# Altium schematic sheet clusterPlusOpamp.SchDoc
size A3; SheetNumber: 3; SheetTotal: 4
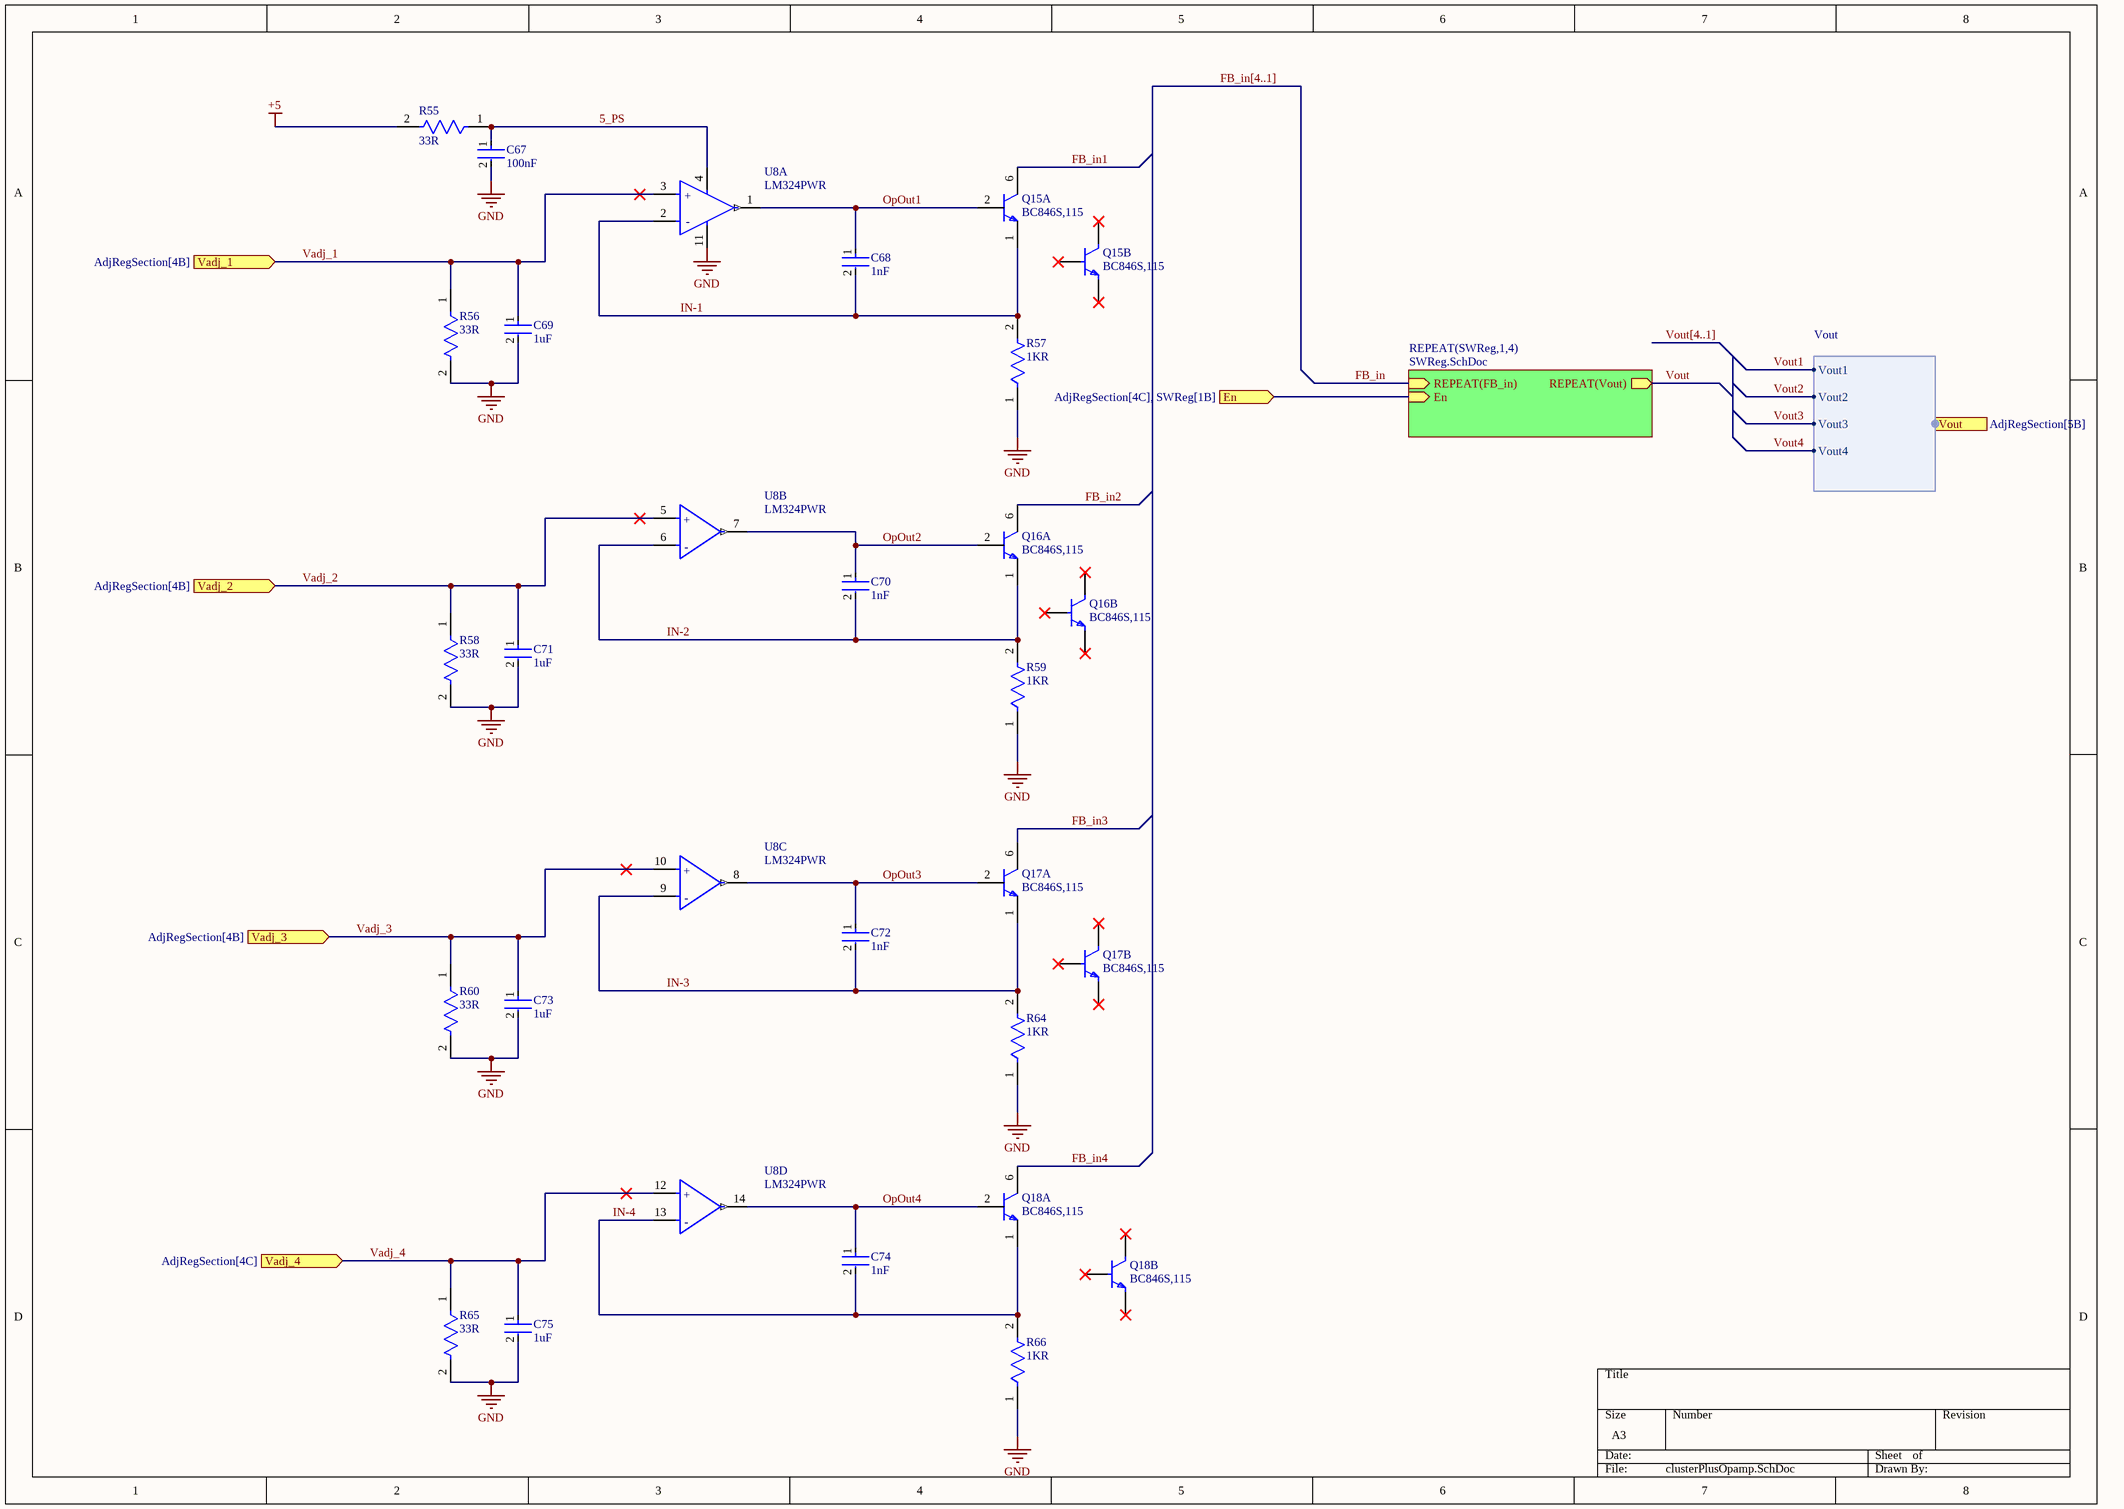
[diagram p0: clusterPlusOpamp.SchDoc]

## Parts
C67  100nF  [FP-CC1206-1_25-MFG]
C68  1nF  [FP-CC1206-1_25-MFG]
C69  1uF  [FP-CC1206-1_25-MFG]
C70  1nF  [FP-CC1206-1_25-MFG]
C71  1uF  [FP-CC1206-1_25-MFG]
C72  1nF  [FP-CC1206-1_25-MFG]
C73  1uF  [FP-CC1206-1_25-MFG]
C74  1nF  [FP-CC1206-1_25-MFG]
C75  1uF  [FP-CC1206-1_25-MFG]
Q15  BC846S,115  [FP-SOT363-MFG]  (parts A,B of 2)
Q16  BC846S,115  [FP-SOT363-MFG]  (parts A,B of 2)
Q17  BC846S,115  [FP-SOT363-MFG]  (parts A,B of 2)
Q18  BC846S,115  [FP-SOT363-MFG]  (parts A,B of 2)
R55  33R  [FP-RC0603-0_55-MFG]
R56  33R  [FP-RC0603-0_55-MFG]
R57  1KR  [FP-RC0603-0_55-MFG]
R58  33R  [FP-RC0603-0_55-MFG]
R59  1KR  [FP-RC0603-0_55-MFG]
R60  33R  [FP-RC0603-0_55-MFG]
R64  1KR  [FP-RC0603-0_55-MFG]
R65  33R  [FP-RC0603-0_55-MFG]
R66  1KR  [FP-RC0603-0_55-MFG]
U8  LM324PWR  [FP-PW0014A-MFG]  (parts A,B,C,D of 4)

## Sub-sheets
REPEAT(SWReg,1,4) = SWReg.SchDoc: REPEAT(Vout) (out), REPEAT(FB_in) (in), En (in)

## Ports
En (in, see AdjRegSection[4C], SWReg[1B]), Vadj_1 (in, see AdjRegSection[4B]), Vadj_2 (in, see AdjRegSection[4B]), Vadj_3 (in, see AdjRegSection[4B]), Vadj_4 (in, see AdjRegSection[4C]), Vout (harness Vout, see AdjRegSection[5B])

## Harnesses
Vout: Vout1, Vout2, Vout3, Vout4

## Nets
+5: R55.2
GND: C67.2 C69.2 C71.2 C73.2 C75.2 R56.2 R57.1 R58.2 R59.1 R60.2 R64.1 R65.2 R66.1 U8.11(GND)
5_PS: C67.1 R55.1 U8.4(VCC)
En: port En, sheet REPEAT(SWReg,1,4)/En
FB_in: sheet REPEAT(SWReg,1,4)/REPEAT(FB_in)
FB_in1: Q15.6(C)
FB_in2: Q16.6(C)
FB_in3: Q17.6(C)
FB_in4: Q18.6(C)
IN-1: C68.2 Q15.1(E) R57.2 U8.2(1IN-)
IN-2: C70.2 Q16.1(E) R59.2 U8.6(2IN-)
IN-3: C72.2 Q17.1(E) R64.2 U8.9(3IN-)
IN-4: C74.2 Q18.1(E) R66.2 U8.13(4IN-)
OpOut1: C68.1 Q15.2(B) U8.1(1OUT)
OpOut2: C70.1 Q16.2(B) U8.7(2OUT)
OpOut3: C72.1 Q17.2(B) U8.8(3OUT)
OpOut4: C74.1 Q18.2(B) U8.14(4OUT)
Vadj_1: C69.1 R56.1 U8.3(1IN+) ; port Vadj_1
Vadj_2: C71.1 R58.1 U8.5(2IN+) ; port Vadj_2
Vadj_3: C73.1 R60.1 U8.10(3IN+) ; port Vadj_3
Vadj_4: C75.1 R65.1 U8.12(4IN+) ; port Vadj_4
Vout: sheet REPEAT(SWReg,1,4)/REPEAT(Vout)
Vout1: port Vout.Vout1
Vout2: port Vout.Vout2
Vout3: port Vout.Vout3
Vout4: port Vout.Vout4

Not connected (* = marked no-connect by the designer): Q15 3(C)* 4(E)* 5(B)*; Q16 3(C)* 4(E)* 5(B)*; Q17 3(C)* 4(E)* 5(B)*; Q18 3(C)* 4(E)* 5(B)*

## Buses and harness runs
bus FB_in[4..1]
bus Vout[4..1]

## Notes on the sheet
- (in symbol CMP-04895-000037-1, part A) +; -
- (in symbol CMP-04895-000037-1, part B) +; -
- (in symbol CMP-04895-000037-1, part C) +; -
- (in symbol CMP-04895-000037-1, part D) +; -

## Library data of the parts
C67 = CMP-03422-000842-1: CAP CER 0.1UF 50V X7R 1206; Manufacturer: Yageo; Manufacturer Part Number: CC1206KRX7R9BB104; Automotive Grade: NA; Tolerance: 0.1; Material: Ceramic; Temperature Coefficient: 15%; Temperature Characteristic: X7R; Device Class L1: Passive Components; Lead Free: Yes; Octopart: https://octopart.com/cc1206krx7r9bb104-yageo-39467816; Category: Cap; Value: 100 nF; Temperature Range Low: -55°C; Device Class L3: Ceramic Capacitors; Voltage Rating: 50 V; Temperature Range High: +125°C; Device Class L2: Capacitors; RoHS: TRUE; Package: CC1206-1.25; Footprint Url: http://www.yageo.com/exep/pages/download/literatures/UPY-C_GEN_24.pdf; ComponentLink2Description: Datasheet; Temperature: -55°C to +125°C; Capacitance: 100 nF; Digikey Description: CAP CER 0.1UF 50V X7R 1206; Height: 1.45mm; Automotive: No; Mouser Description: Multilayer Ceramic Capacitors MLCC - SMD/SMT 100nF 50V X7R 10%; ComponentLink2URL: http://www.yageo.com/documents/recent/UPY-NP0X7R_HV_1KV-to-3KV_11.pdf
C68-C75 = CMP-03422-000842-1: CAP CER 0.1UF 50V X7R 1206; Manufacturer: Yageo; Manufacturer Part Number: CC1206KRX7R9BB104; Automotive Grade: NA; Value: 100 nF; Tolerance: 0.1; Material: Ceramic; Temperature Coefficient: 15%; Temperature Characteristic: X7R; Device Class L1: Passive Components; Lead Free: Yes; Octopart: https://octopart.com/cc1206krx7r9bb104-yageo-39467816; Category: Cap; Temperature Range Low: -55°C; Device Class L3: Ceramic Capacitors; Voltage Rating: 50 V; Temperature Range High: +125°C; Device Class L2: Capacitors; RoHS: TRUE; Package: CC1206-1.25; Footprint Url: http://www.yageo.com/exep/pages/download/literatures/UPY-C_GEN_24.pdf; ComponentLink2Description: Datasheet; Temperature: -55°C to +125°C; Capacitance: 100 nF; Digikey Description: CAP CER 0.1UF 50V X7R 1206; Height: 1.45mm; Automotive: No; Mouser Description: Multilayer Ceramic Capacitors MLCC - SMD/SMT 100nF 50V X7R 10%; ComponentLink2URL: http://www.yageo.com/documents/recent/UPY-NP0X7R_HV_1KV-to-3KV_11.pdf
Q15-Q18 = CMP-14406-000015-1: TRANS 2NPN 65V 0.1A 6TSSOP; Manufacturer: Nexperia; Collector Emitter Saturation Voltage: 300mV; Hfe Testvce: 5V; Max Collector Current: 100mA; Automotive Grade: Grade 0; Hfe Testic: 2mA; Hfe Min: 110; Collector Base Voltage: 80V; Max Junction Temp: +150°C; Rthja Max: 416K/W; Emitter Base Voltage: 6V; Number Of Elements: 2; Unity Gain Freq: 100MHz; Power Dissipation: 300mW; Device Class L2: Transistors; Lead Free: Yes; Height: 1.1mm; ComponentLink2URL: https://assets.nexperia.com/documents/data-sheet/BC846S.pdf; Temperature: to +150°C; Ambient Temperature Range Low: -65°C; Collector Emitter Voltage: 65V; Temperature Range High: +150°C; Category: Trans; Automotive: Yes; Octopart: https://octopart.com/bc846s%2C115-nexperia-78739099; Digikey Description: TRANS 2NPN 65V 0.1A 6TSSOP; Ambient Temperature Range High: +150°C; Footprint Url: https://assets.nexperia.com/documents/outline-drawing/SOT363.pdf; Device Class L3: BJTs; Device Class L1: Discrete Semiconductors; Package: SOT363; RoHS: TRUE; Manufacturer Part Number: BC846S,115; Number Of Npn: 2; ComponentLink2Description: Datasheet
R55-R60 R64-R66 = CMP-2100-03662-2: RES SMD 100K OHM 1% 1/10W 0603; Voltage Rating (DC): 50V; Resistance: 100kR; Max Power Dissipation: 100mW; Temperature Coefficient: 100ppm/°C; Working Voltage: 75V; Length: 1.6mm; Lead Free: Lead Free; Number of Terminations: 2; Packaging: Tape and Reel; Voltage Rating: 50V; Termination: SMD/SMT; Width: 0.8mm; Resistor Type: Thick Film; Resistance Tolerance: 1%; Features: Moisture Resistant; Height: 0.45mm; Construction: Rectangular; Case/Package: 0603; Military Standard: Not; Case Code (Imperial): 0603; Series: RC; Technology: THICK FILM; Depth: 0.8mm; RoHS Compliant: Yes; REACH SVHC: No SVHC; Min Operating Temperature: -55°C; Case Code (Metric): 1608; Max Operating Temperature: 155°C; Power Rating: 100mW; Number of Pins: 2; Tolerance: 1%
U8 = CMP-04895-000037-1: IC OPAMP GP 4 CIRCUIT 14TSSOP; Manufacturer: Texas Instruments; Voltage Gain: 100V/mV; Input Bias Current: -0.02uA; Output Current Per Channel: 20mA; Gain Bandwidth: 1.2MHz; Standoff Height: 0.05mm; Max Supply Voltage: 32V; Max Junction Temp: +150°C; Number Of Channels: 4; Input Offset Voltage: 3mV; Min Dual Supply Voltage: 1.5V; Min Supply Voltage: 3V; Max Dual Supply Voltage: 16V; Nominal Supply Current: 0.7-1.4mA; Temperature: 0°C to +70°C; Ambient Temperature Range Low: 0°C; Octopart: https://octopart.com/lm324pwr-texas+instruments-410375; Device Class L1: Integrated Circuits (ICs); Automotive: No; Package: PW0014A; Lead Free: Yes; Device Class L2: Linear ICs; Ambient Temperature Range High: +70°C; Device Class L3: Amplifiers - Op Amps; Height: 1.2mm; Temperature Range Low: 0°C; ComponentLink2Description: Datasheet; Category: IC; ComponentLink2URL: http://www.ti.com/lit/ds/symlink/lm324.pdf; Mouser Description: OP Amp Quad General Purpose ±16 Volt/32 Volt 14-Pin TSSOP; Digikey Description: IC OPAMP GP 4 CIRCUIT 14TSSOP; RoHS: TRUE; Temperature Range High: +70°C; Manufacturer Part Number: LM324PWR